# EAGLE design PCM2902Breakout (EAGLE 6.5.0)
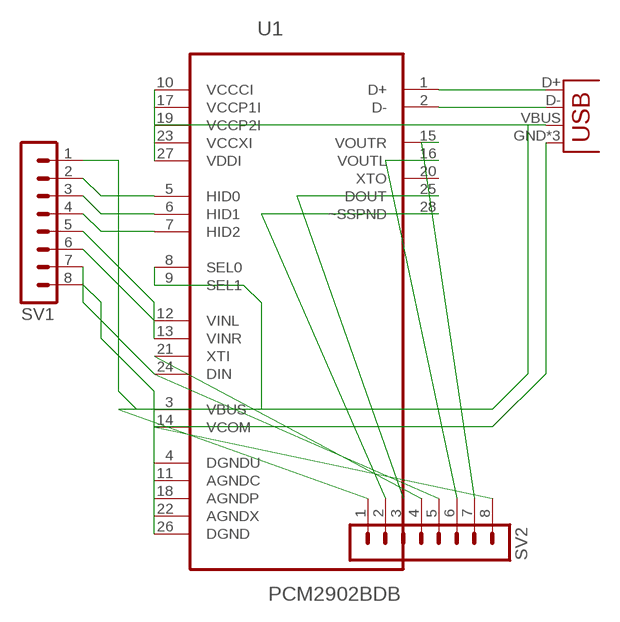
[diagram p0: schematic, sheet 1]

## Parts
JP1  USB-MICROB  [USB-MICROB]
SV1  MA08-1  [MA08-1]
SV2  MA08-1  [MA08-1]
U1  PCM2902BDB  [SOP65P780X200-28N]

## Nets
N$1: JP1.D+ U1.1(D+)
N$2: JP1.D- U1.2(D-)
N$3: SV1.2 U1.5(HID0)
N$4: JP1.GND JP1.MT1(GND) JP1.MT2(GND) SV1.8 SV2.8 U1.4(DGNDU) U1.11(AGNDC) U1.14(VCOM) U1.18(AGNDP) U1.22(AGNDX) U1.26(DGND)
N$5: SV1.3 U1.6(HID1)
N$6: SV1.4 U1.7(HID2)
N$7: JP1.VBUS SV1.1 SV2.1 U1.3(VBUS) U1.8(SEL0) U1.9(SEL1) U1.10(VCCCI) U1.17(VCCP1I) U1.19(VCCP2I) U1.23(VCCXI) U1.27(VDDI)
N$8: SV1.5 U1.12(VINL)
N$9: SV1.6 U1.13(VINR)
N$10: SV1.7 U1.24(DIN)
N$11: SV2.2 U1.28(~SSPND)
N$12: SV2.3 U1.25(DOUT)
N$13: SV2.4
N$14: SV2.6 U1.16(VOUTL)
N$15: SV2.7 U1.15(VOUTR)
N$16: SV2.5
Unconnected: U1.20(XTO) U1.21(XTI)

## Library data of the parts
JP1 = SparkFun-Connectors:USB: USB Connectors USB-B-PTH is fully proven SKU : PRT-00139/CONN-08278 USB-miniB is fully proven SKU : PRT-00587 USB-A-PCB is untested. USB-A-H is throughly reviewed, but untested. Spark Fun Electronics SKU : PRT-00437 USB-B-SMT is throughly reviewed, but untested. Needs silkscreen touching up. USB-A-S has not been used/tested USB-MB-H has not been used/tested USB-MICROB has been used. CONN-09505; PROD_ID: CONN-09505
SV1 SV2 = con-lstb:MA08-1: PIN HEADER; OC_FARNELL: unknown; OC_NEWARK: unknown
U1 = Texas Instruments_By_element14_Batch_1:PCM2902BDB: STEREO AUDIO CODEC; MPN: PCM2902BDB; OC_FARNELL: -; OC_NEWARK: 09R5060; PACKAGE: SSOP-28; SUPPLIER: Texas Instruments

## Board
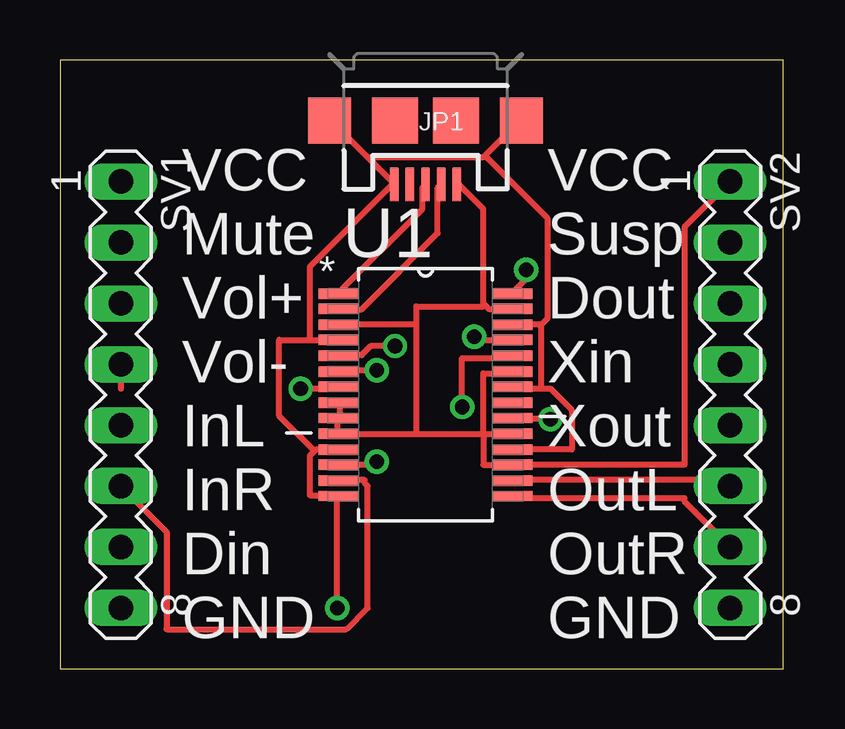
[diagram p1: board, top side]
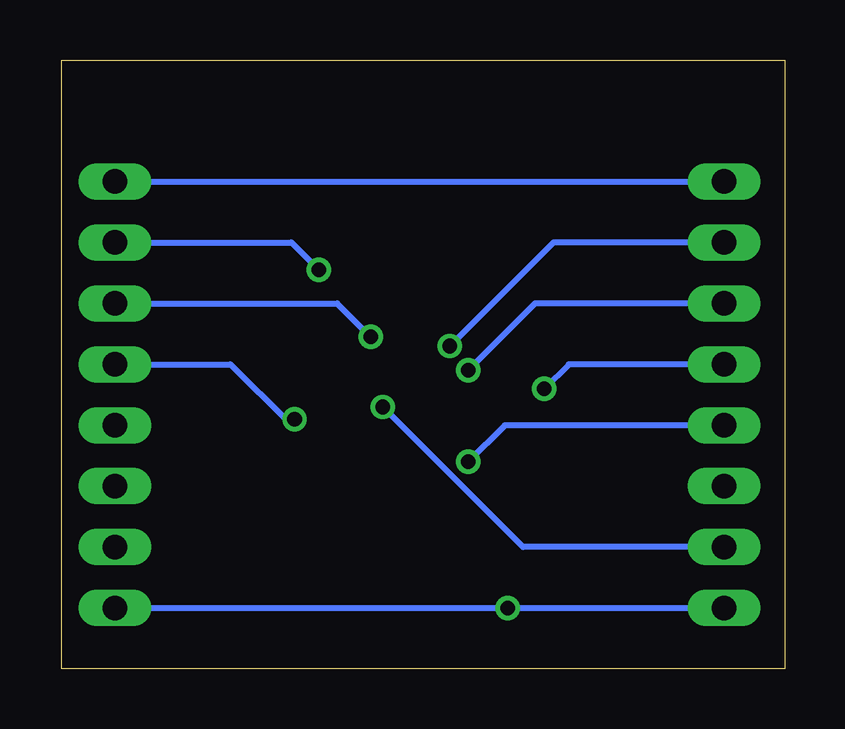
[diagram p2: board, bottom side, seen from below]

Size 30.15 x 25.39 mm. Coordinates in mm from the lower left corner, seen from the top.
Outline: 0,0 30.15,0 30.15,25.39 0,25.39 0,0
Copper layers (1*16): Top 0.035mm / dielectric 1.5mm / Bottom 0.035mm
Design rules "default": minimum track width 10mil, minimum drill 24mil, track to track 8mil, track to pad 8mil, pad to pad 8mil, via to via 8mil, smd to smd 8mil, copper to edge 40mil, drill to drill 8mil, minimum pad ring 10mil, minimum via ring 8mil, stop-mask expansion 4mil, vias tented up to drill 0mil, thermal gap 10mil

### Footprints (pad centres in the part's own frame; a part is rotated, then mirrored left to right if it is on the bottom)
USB-MICROB = smd 0.35 x 1.4: D+ 0,2.65; D- -0.65,2.65; GND 1.3,2.65; ID 0.65,2.65; VBUS -1.3,2.65 | smd 1.8 x 1.9: MT1 -4,0; MT2 4,0 | smd 1.9 x 1.9: P$1 -1.27,0; P$2 1.27,0
MA08-1 = drill 1.016 long: 1 -8.89,0; 2 -6.35,0; 3 -3.81,0; 4 -1.27,0; 5 1.27,0; 6 3.81,0; 7 6.35,0; 8 8.89,0
SOP65P780X200-28N = smd 1.651 x 0.432: 1 -3.632,4.216; 2 -3.632,3.581; 3 -3.632,2.921; 4 -3.632,2.286; 5 -3.632,1.626; 6 -3.632,0.965; 7 -3.632,0.33; 8 -3.632,-0.33; 9 -3.632,-0.965; 10 -3.632,-1.626; 11 -3.632,-2.286; 12 -3.632,-2.921; 13 -3.632,-3.581; 14 -3.632,-4.216; 15 3.632,-4.216; 16 3.632,-3.581; 17 3.632,-2.921; 18 3.632,-2.286; 19 3.632,-1.626; 20 3.632,-0.965; 21 3.632,-0.33; 22 3.632,0.33; 23 3.632,0.965; 24 3.632,1.626; 25 3.632,2.286; 26 3.632,2.921; 27 3.632,3.581; 28 3.632,4.216

### Placement (x,y rotation side)
JP1  15.24,22.86 180 top
SV1  2.54,11.43 270 top
SV2  27.94,11.43 270 top
U1  15.24,11.43 0 top

### Tracks (layer width: path | path; a pad name or v marks a point on that pad's centre or on a via)
N$1
  Top 0.254: JP1.D+ 15.24,20.19 15.11,20.07 15.11,19.18 11.68,15.75 U1.1
N$2
  Top 0.254: JP1.D- 15.88,20.19 15.75,20.07 15.75,18.16 12.57,14.99 11.68,14.99 U1.2
N$3  (via drill 0.61)
  Top 0.254: v13.97,13.46 12.95,13.46 12.57,13.08 11.68,13.08 U1.5
  Bottom 0.254: v13.97,13.46 9.65,17.78 SV1.2
N$4  (via drill 0.61)
  Top 0.254: 10.6,9.08 10.67,9.14 U1.11 | 10.6,9.08 10.41,8.89 10.41,7.24 11.56,7.24 U1.14 11.56,7.11 v11.56,2.54 | 10.41,13.72 9.14,13.72 9.14,10.54 10.6,9.08 | 10.41,13.72 U1.4 | U1.18 21.34,9.14 21.34,10.79 20.45,11.68 20.07,11.68 | 20.07,11.68 18.92,11.68 U1.22 | 20.07,14.35 U1.26 | 20.07,11.68 20.07,14.35 | 12.89,21.27 11.3,22.86 JP1.MT2 | 12.89,21.27 13.84,20.32 JP1.GND 13.84,20.19 10.41,16.76 10.41,13.72 | 17.72,21.4 17.65,21.34 12.95,21.34 12.89,21.27 | 17.72,21.4 19.18,22.86 JP1.MT1 | 20.07,14.35 20.32,14.6 20.32,18.8 17.72,21.4
  Bottom 0.254: SV2.8 v11.56,2.54 SV1.8
N$5  (via drill 0.61)
  Top 0.254: v13.21,12.45 11.68,12.45 U1.6
  Bottom 0.254: v13.21,12.45 10.41,15.24 SV1.3
N$6  (via drill 0.61)
  Top 0.254: SV1.4 2.54,11.68 | 11.43,11.68 U1.7 11.3,11.68 v10.03,11.68
  Bottom 0.254: v10.03,11.68 9.02,12.7 SV1.4
N$7
  Top 0.254: U1.8 11.68,10.92 11.68,10.67 U1.9 11.56,10.41 11.56,9.91 U1.10 11.68,9.78 14.86,9.78 | 17.72,15.18 17.91,14.99 18.8,14.99 U1.27 | 17.72,15.18 17.65,15.24 17.65,19.18 16.64,20.19 JP1.VBUS | 17.65,9.78 18.8,9.78 U1.19 | 17.65,9.78 14.86,9.78 | 14.86,14.35 U1.3 | 14.86,9.78 14.86,14.35 | 17.65,9.78 17.65,8.51 U1.17 26.04,8.51 26.04,18.41 SV2.1 | 17.65,9.78 17.65,12.32 18.8,12.32 U1.23 | 14.86,14.35 14.86,15.11 17.65,15.11 17.72,15.18
  Bottom 0.254: SV2.1 SV1.1
N$8  (via drill 0.61)
  Top 0.254: U1.12 13.21,8.51 v13.21,8.64
  Bottom 0.254: v13.21,8.64 11.68,10.16 SV1.5
N$9
  Top 0.254: SV1.6 4.45,5.71 4.45,1.65 11.94,1.65 12.83,2.54 12.83,7.62 12.7,7.75 12.7,7.87 11.68,7.87 U1.13
N$10  (via drill 0.61)
  Top 0.254: v16.76,10.92 16.76,12.95 18.8,12.95 U1.24
  Bottom 0.254: v16.76,10.92 10.92,5.08 SV1.7
N$11  (via drill 0.61)
  Top 0.254: v19.43,16.64 19.43,16.26 18.92,15.75 U1.28
  Bottom 0.254: v19.43,16.64 20.57,17.78 SV2.2
N$12  (via drill 0.61)
  Top 0.254: U1.25 17.27,13.72 v17.27,13.84
  Bottom 0.254: v17.27,13.84 18.67,15.24 SV2.3
N$13  (via drill 0.61)
  Top 0.254: v20.45,10.41 18.92,10.41
  Bottom 0.254: 20.7,10.16 v20.45,10.41 20.7,10.29 23.11,12.7 SV2.4
N$14
  Top 0.254: SV2.6 27.94,7.87 18.92,7.87 U1.16
N$15
  Top 0.254: SV2.7 26.04,6.98 26.04,7.11 18.92,7.11 U1.15

### Text on the board
tPlace: VCC / Mute / Vol+ / Vol- / InL / InR / Din / GND | VCC / Susp / Dout / Xin / Xout / OutL / OutR / GND